# Altium schematic sheet Power Distribution.SchDoc
size A; Organization: Underwater Robotics; Address1: c/o Student Involvement; Address2: Campus Box 7306; Address3: 2016 Cates Ave. Raleigh, NC 27695; Revision: A1; SheetNumber: 2C; SheetTotal: 2C
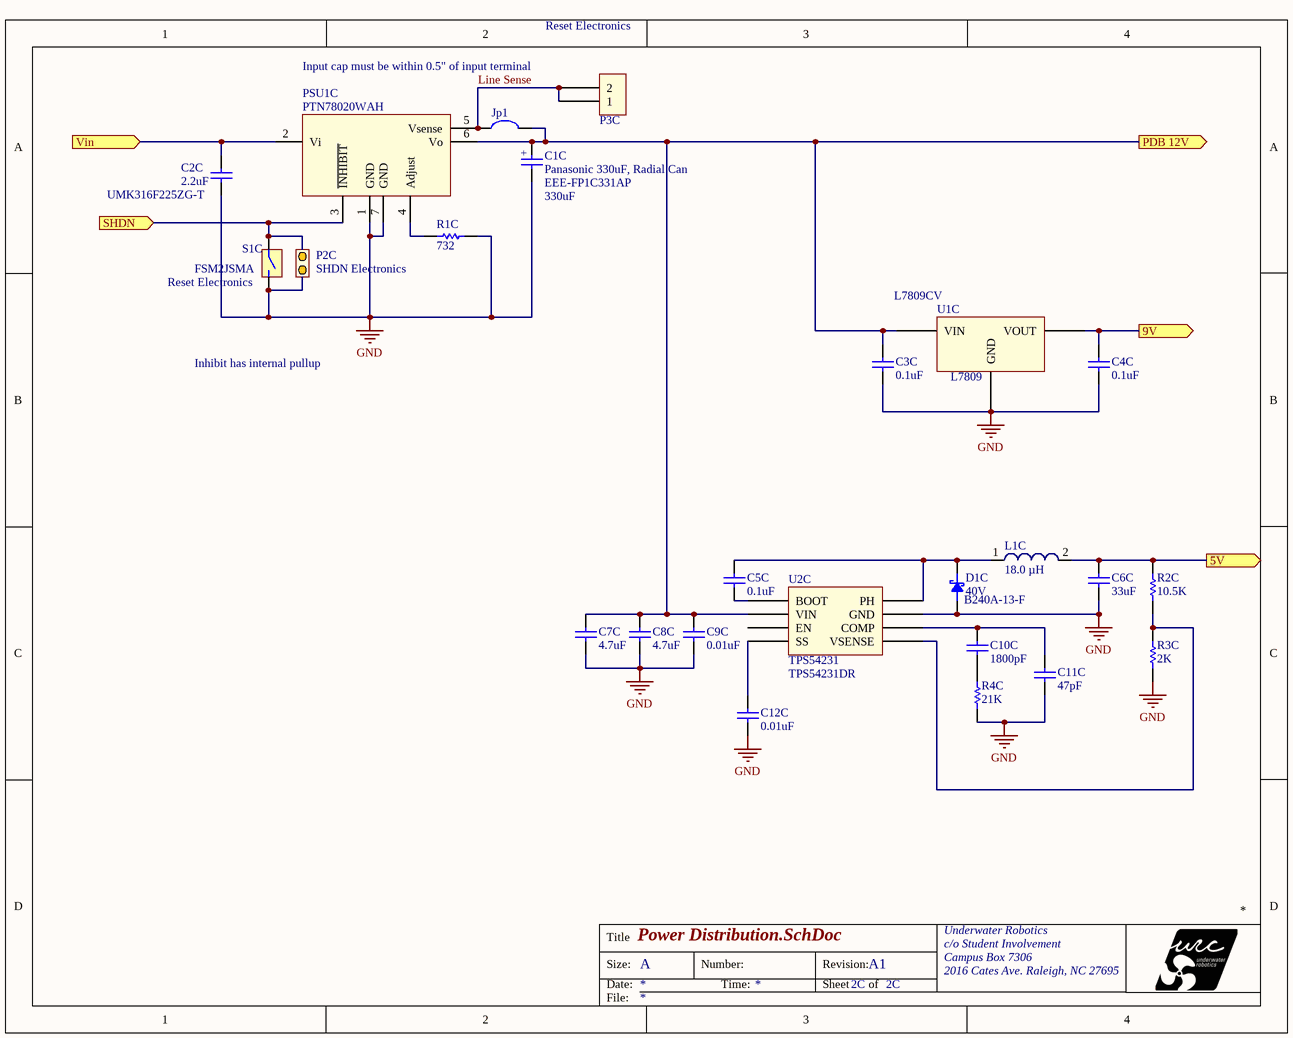
[diagram p0: Power Distribution.SchDoc]

## Parts
C1C  Panasonic 330uF, Radial Can  value 330uF  [EEE-FP1C331AP]
C2C  value 2.2uF  Manufacturer Part Number: UMK316F225ZG-T  [C1206]  (hidden comment: 2.2uF, C1206 TY , Ceramic MLCC)
C3C  value 0.1uF  [C0603]  (hidden comment: 0.1uF, C0603, MultiComp)
C4C  value 0.1uF  [C0603]  (hidden comment: 0.1uF, C0603, MultiComp)
C5C  value 0.1uF  [C0603]  (hidden comment: 0.1uF, C0603, MultiComp)
C6C  value 33uF  [C1210]  (hidden comment: 33uF, 6.3V, C1210, TDK)
C7C  value 4.7uF  [C0805]  (hidden comment: 4.7uF, C0805, Multicomp)
C8C  value 4.7uF  [C0805]  (hidden comment: 4.7uF, C0805, Multicomp)
C9C  value 0.01uF  [C0603]  (hidden comment: 0.01uF, C0603, AVX)
C10C  value 1800pF  [C0603]  (hidden comment: 1800pF, 50V, C0603, Multicomp)
C11C  value 47pF  [C0402]  (hidden comment: 47pF, 50V, C0402, Yageo)
C12C  value 0.01uF  [C0603]  (hidden comment: 0.01uF, C0603, AVX)
D1C  value 40V  Manufacturer Part Number: B240A-13-F  [SCHOTTKY-B220/A]  (hidden comment: Shottky)
Jp1  Jumper  [Jumper (optional) SMD]  (value not drawn)
L1C  18.0 µH  [WE-PD 1245]
P2C  Header  [1x2 Header]  (value not drawn)
P3C  Header  [1x2 Header]  (value not drawn)
PSU1C  Manufacturer Part Number: PTN78020WAH  [PTN78020]  (hidden comment: PTN78020W)
R1C  value 732  [R0402]  (hidden comment: Resistor)
R2C  value 10.5K  [R0603]  (hidden comment: Resistor)
R3C  value 2K  [R0603]  (hidden comment: Resistor)
R4C  value 21K  [R0603]  (hidden comment: Resistor)
S1C  FSM2JSMA  [FSM2JSMA]
U1C  L7809  Manufacturer Part Number: L7809CV  [L7809CD2T-D2PAK]
U2C  TPS54231  Manufacturer Part Number: TPS54231DR  [TPS54231-SOIC8]

## Ports
5V (out), 9V (out), PDB 12V (out), SHDN (in), Vin (in)

## Nets
GND: C1C.2 C2C.2 C3C.2 C4C.2 C6C.2 C7C.2 C8C.2 C9C.2 C11C.2 C12C.2 D1C.2 P2C.2 PSU1C.1(GND) PSU1C.7(GND) R1C.2 R3C.1 R4C.1 S1C.3 S1C.4 U1C.GND U2C.GND
5V: C6C.1(+) L1C.2 R2C.2 ; port 5V
9V: C4C.1(+) U1C.OUTPUT(VOUT) ; port 9V
Line Sense: Jp1.1 P3C.1 P3C.2 PSU1C.5(Vsense)
PDB 12V: C1C.1(+) C3C.1(+) C7C.1(+) C8C.1(+) C9C.1(+) Jp1.2 PSU1C.6(Vo) U1C.INPUT(VIN) U2C.VIN ; port PDB 12V
SHDN: P2C.1 PSU1C.3(~{INHIBIT}) S1C.1 S1C.2 ; port SHDN
Vin: C2C.1(+) PSU1C.2(Vi) ; port Vin
NetC5C_1: C5C.1(+) D1C.1 L1C.1 U2C.PH
NetC5C_2: C5C.2 U2C.BOOT
NetC10C_1: C10C.1(+) C11C.1(+) U2C.COMP
NetC10C_2: C10C.2 R4C.2
NetC12C_1: C12C.1(+) U2C.SS
NetPSU1C_4: PSU1C.4(Adjust) R1C.1
NetR2C_1: R2C.1 R3C.2 U2C.VSENSE

Not connected (* = marked no-connect by the designer): U2C EN

## Notes on the sheet
- Reset Electronics
- (near P3C) Input cap must be within 0.5" of input terminal
- (near S1C) Reset Electronics
- (near P2C) SHDN Electronics
- Inhibit has internal pullup
- Title
- Size:
- Date:
- A
- Number:
- Time:
- Revision:
- Sheet
- of
- File:

## Library data of the parts
C1C = Panasonic 330uF, Radial Can: Aluminum Radial Can, Panasonic, 330uF, 16V, SMD; Manufacturer 1: PANASONIC ELECTRONIC COMPONENTS; Description 1: PANASONIC ELECTRONIC COMPONENTS - EEE-FP1C331AP - ALUMINUM ELECTROLYTIC CAPACITOR, 330UF, 16V, 20%, SMD; Product Range: AEC-Q200 FP Series; Voltage Rating: 16; AE Capacitor Case: Radial Can - SMD; ESR: 0.08; Ripple Current AC: 850; Supplier 1: Newark; Supplier Part Number 1: 32R8907; RoHS: YES; Stock 1: 718; Pricing 1: 1=0.223, 50=0.223, 100=0.223, 250=0.223 (USD); Capacitance: 330 uF; Diameter: 8; Height: 10.2; ComponentLink1URL: http://www.farnell.com/datasheets/370232.pdf; ComponentLink1Description: http://www.farnell.com/datasheets/370232.pdf; ComponentLink2URL: http://www.farnell.com/cad/1703920.zip; ComponentLink2Description: http://www.farnell.com/cad/1703920.zip; Manufacturer Part Number: EEE-FP1C331AP
C2C = 2.2uF, C1206 TY , Ceramic MLCC: Ceramic MLCC, Taiyo Yuden, X7R Dielectric; Description 1: TAIYO YUDEN - UMK316F225ZG-T - CERAMIC CAPACITOR, 2.2UF, 50V, Y5V, +80,-20%, 1206; Supplier 1: Newark; Supplier Part Number 1: 08P5201; Manufacturer 1: TAIYO YUDEN; RoHS: YES; Stock 1: 1843; Pricing 1: 1=0.055, 10=0.055, 50=0.055, 100=0.055, 500=0.055, 1000=0.05 (USD); ComponentLink1URL: http://www.yuden.co.jp/productdata/catalog/en/mlcc_pack_e.pdf; ComponentLink1Description: http://www.yuden.co.jp/productdata/catalog/en/mlcc_pack_e.pdf; ComponentLink2URL: http://www.farnell.com/datasheets/1481447.pdf; ComponentLink2Description: http://www.farnell.com/datasheets/1481447.pdf
C3C C4C C5C = 0.1uF, C0603, MultiComp: Ceramic MLCC, Multicompo, X7R Dielectric; Manufacturer Part Number: MC0603B104K500CT; Description 1: MULTICOMP - MC0603B104K500CT - CERAMIC CAPACITOR, 0.1UF, 50V, X7R, 10%, 0603; Product Range: MC Series; Capacitance: 0.1 F; Capacitance Tolerance: 10%; Dielectric Characteristic: X7; Voltage Rating: 50; Ceramic Capacitor Case: 0603 [1608 Metric]; Supplier 1: Newark; Supplier Part Number 1: 06R4927; Manufacturer 1: MULTICOMP; RoHS: YES; Stock 1: 166516; Pricing 1: 1=0.075, 10=0.048, 50=0.027, 100=0.021, 250=0.017, 500=0.015, 1000=0.012 (USD); Packaging: Cut Tape; ComponentLink1URL: http://www.farnell.com/datasheets/1522998.pdf; ComponentLink1Description: http://www.farnell.com/datasheets/1522998.pdf; ComponentLink2URL: /pdfs/datasheets/spc/Ta-1098.pdf; ComponentLink2Description: /pdfs/datasheets/spc/Ta-1098.pdf
C6C = 33uF, 6.3V, C1210, TDK: Ceramic MLCC, TDK, X5R Dielectric; Manufacturer Part Number: C3225X5R0J336M250AA; Description 1: TDK - C3225X5R0J336M250AA - CERAMIC CAPACITOR, 33UF, 6.3V, X5R, 20%, 1210; Supplier 1: Newark; Supplier Part Number 1: 91R0108; Manufacturer 1: TDK; RoHS: YES; Stock 1: 980; Pricing 1: 1=0.72, 10=0.675, 50=0.54, 100=0.513, 500=0.414 (USD); ComponentLink1URL: http://www.farnell.com/datasheets/1571323.pdf; ComponentLink1Description: http://www.farnell.com/datasheets/1571323.pdf
C7C C8C = 4.7uF, C0805, Multicomp: Ceramic MLCC, Multicomp, X5R Dielectric; Manufacturer Part Number: MC0805X475M100CT; Description 1: MULTICOMP - MC0805X475M100CT - CERAMIC CAPACITOR, 4.7UF, 10V, X5R, 20%, 0805; Supplier 1: Newark; Supplier Part Number 1: 06R4184; Manufacturer 1: MULTICOMP; RoHS: YES; Stock 1: 9541; Pricing 1: 1=0.019, 10=0.019, 50=0.019, 100=0.019, 250=0.019, 500=0.019, 1000=0.019 (USD); ComponentLink1URL: http://www.newark.com/pdfs/datasheets/spc/Ta-1105.pdf; ComponentLink1Description: http://www.newark.com/pdfs/datasheets/spc/Ta-1105.pdf; ComponentLink2URL: /pdfs/datasheets/spc/Ta-1105.pdf; ComponentLink2Description: /pdfs/datasheets/spc/Ta-1105.pdf
C9C C12C = 0.01uF, C0603, AVX: Ceramic MLCC, AVX, X7R Dielectric; Manufacturer Part Number: 06035C103KAT2A; Description 1: AVX - 06035C103KAT2A - CERAMIC CAPACITOR 0.01UF, 50V, X7R, 10%, 0603; Supplier 1: Newark; Supplier Part Number 1: 36K3729; Manufacturer 1: AVX; RoHS: YES; Stock 1: 141733; Pricing 1: 1=0.003, 10=0.003, 100=0.003, 250=0.003, 500=0.003, 1000=0.003 (USD); ComponentLink1URL: http://www.farnell.com/cad/1614338.zip; ComponentLink1Description: http://www.farnell.com/cad/1614338.zip; ComponentLink2URL: http://www.farnell.com/datasheets/1818074.pdf; ComponentLink2Description: http://www.farnell.com/datasheets/1818074.pdf
C10C = 1800pF, 50V, C0603, Multicomp: Ceramic MLCC, Multicomp, X7R Dielectric; Manufacturer Part Number: MC0603B182K500CT; Description 1: MULTICOMP - MC0603B182K500CT - CERAMIC CAPACITOR 1800PF, 50V, X7R, 10%, 0603; Supplier 1: Newark; Supplier Part Number 1: 06R4952; Manufacturer 1: MULTICOMP; RoHS: YES; Stock 1: 13906; Pricing 1: 1=0.001, 10=0.001, 50=0.001, 100=0.001, 250=0.001, 500=0.001, 1000=0.001 (USD); ComponentLink1URL: http://www.farnell.com/datasheets/1522998.pdf; ComponentLink1Description: http://www.farnell.com/datasheets/1522998.pdf; ComponentLink2URL: /pdfs/datasheets/spc/Ta-1098.pdf; ComponentLink2Description: /pdfs/datasheets/spc/Ta-1098.pdf
C11C = 47pF, 50V, C0402, Yageo: Ceramic MLCC, Yageo, C0G/NP0 Dielectric; Manufacturer Part Number: CC0402JRNPO9BN470; Description 1: YAGEO - CC0402JRNPO9BN470 - CERAMIC CAPACITOR 47PF 50V, C0G, 5%, 0402; Supplier 1: Newark; Supplier Part Number 1: 68R4613; Manufacturer 1: YAGEO; RoHS: YES; Stock 1: 18071; Pricing 1: 1=0.1, 10=0.013, 25=0.009, 100=0.006, 250=0.005, 500=0.005, 1000=0.004 (USD); ComponentLink1URL: http://www.farnell.com/datasheets/1443161.pdf; ComponentLink1Description: http://www.farnell.com/datasheets/1443161.pdf; ComponentLink2URL: http://www.yageo.com/pdf/yageo/NP0_16V-to-100V_6.pdf; ComponentLink2Description: http://www.yageo.com/pdf/yageo/NP0_16V-to-100V_6.pdf
D1C = Schottky: Manufacturer: MULTICOMP; Diode Configuration: Single; Repetitive Reverse Voltage Vrrm Max: 40; Forward Current If(AV): 2; Diode Case Style: DO-214; Forward Voltage VF Max: 500; Supplier 1: Newark; Supplier Part Number 1: 65W8554; RoHS: YES; Stock 1: 482; Pricing 1: 1=0.048, 10=0.048, 100=0.048, 1000=0.048 (USD); No. of Pins: 2; Packaging: Cut Tape; ComponentLink1URL: http://www.farnell.com/datasheets/1693630.pdf; ComponentLink1Description: http://www.farnell.com/datasheets/1693630.pdf
Jp1 = Jump Optional: Resistor; Value: xxmil
L1C = WE-PD 1245, LS, 7447715180: SMD-Shielded Power Inductor WE-PD, L=18.0 µH; Manufacturer 1: WURTH ELEKTRONIK; Description 1: WURTH ELEKTRONIK - 7447715180 - INDUCTOR, SHIELDED, 18UH, 3.2A, SMD; Value: 18uH; Inductance: 18.0 µH; Supplier 1: Newark; Supplier Part Number 1: 88T7120; Manufacturer Part Number: 7447715180; RoHS: YES; Stock 1: 3; Pricing 1: 1=2.88, 10=2.69, 25=2.46, 50=2.23, 100=2.02, 200=1.87, 500=1.73 (USD); ComponentLink1URL: http://www.farnell.com/cad/1670107.zip; ComponentLink1Description: http://www.farnell.com/cad/1670107.zip; ComponentLink2URL: http://www.farnell.com/datasheets/1919796.pdf; ComponentLink2Description: http://www.farnell.com/datasheets/1919796.pdf
P2C P3C = 1x2 Header
PSU1C = PTN78020W: Adjustable, non-isolating DC-DC converter; Manufacturer: TEXAS INSTRUMENTS; DC / DC Converter Type: DIP; Output Power Max: 90; Output Voltage Min: 2.5; Output Voltage Max: 12.6; Output Current Max: 6; Input Voltage DC Min: 7; Input Voltage DC Max: 36; Supplier 1: Newark; Supplier Part Number 1: 73J8281; RoHS: YES; Stock 1: 315; Pricing 1: 1=30.26, 10=28.02, 25=25.78, 50=25.14, 100=23.86, 250=21.93, 500=20.97, 1000=20.01 (USD); Height: 9; ComponentLink1URL: http://www.farnell.com/datasheets/1874637.pdf; ComponentLink1Description: http://www.farnell.com/datasheets/1874637.pdf
R1C = 732, 1%, 100mW, Panasonic, R0402: Manufacturer 1: PANASONIC ELECTRONIC COMPONENTS; Manufacturer Part Number: ERJ-2RKF7320X; Tolerance: 1%; Description 1: PANASONIC ELECTRONIC COMPONENTS - ERJ-2RKF7320X - RES, THICK FILM, 732R, 1%, 0.1W, 0402; Supplier 1: Newark; Supplier Part Number 1: 53W4460; RoHS: YES; Stock 1: 34626; Pricing 1: 1=0.002, 50=0.002, 100=0.002, 250=0.002, 500=0.002, 1000=0.002, 5000=0.002 (USD); ComponentLink1URL: http://www.farnell.com/cad/1697903.zip; ComponentLink1Description: http://www.farnell.com/cad/1697903.zip; ComponentLink2URL: http://www.farnell.com/datasheets/1836131.pdf; ComponentLink2Description: http://www.farnell.com/datasheets/1836131.pdf
R2C = 10.5K, 1%, 63mW, Multicomp, R0603: Manufacturer Part Number: MC0063W0603110K5; Tolerance: 1%; Description 1: MULTICOMP - MC0063W0603110K5 - RES, THICK FILM, 10K5, 1%, 0.063W, 0603; Supplier 1: Newark; Supplier Part Number 1: 94W5653; Manufacturer 1: MULTICOMP; RoHS: YES; Stock 1: 49133; Pricing 1: 1=0.001, 10=0.001, 100=0.001, 1000=0.001 (USD); ComponentLink1URL: http://www.farnell.com/datasheets/1788326.pdf; ComponentLink1Description: http://www.farnell.com/datasheets/1788326.pdf
R3C = 2k, 1%, 100mW, Yageo, R0603: Manufacturer 1: YAGEO; Manufacturer Part Number: RC0603FR-072KL; Tolerance: 1%; Description 1: YAGEO - RC0603FR-072KL - RES, THICK FILM, 2K, 1%, 0.1W, 0603; Supplier 1: Newark; Supplier Part Number 1: 68R0063; RoHS: YESX; Stock 1: 2730; Pricing 1: 1=0.09, 10=0.015, 25=0.011, 100=0.006, 250=0.004, 1000=0.003 (USD); ComponentLink1URL: http://www.farnell.com/datasheets/1868787.pdf; ComponentLink1Description: http://www.farnell.com/datasheets/1868787.pdf; ComponentLink2URL: http://www.yageo.com/pdf/PYu-RC0603_51_RoHS_L_4.pdf; ComponentLink2Description: http://www.yageo.com/pdf/PYu-RC0603_51_RoHS_L_4.pdf
R4C = 21K, 1%, 100mW, Vishay, R0603: Manufacturer 1: VISHAY DALE; Manufacturer Part Number: CRCW060321K0FKEA; Tolerance: 1%; Description 1: VISHAY DALE - CRCW060321K0FKEA - RES, THICK FILM, 21K, 1%, 0.1W, 0603; Supplier 1: Newark; Supplier Part Number 1: 52K8277; RoHS: YESX; Stock 1: 6009; Pricing 1: 1=0.004, 10=0.004, 100=0.004, 500=0.004, 1000=0.004 (USD); ComponentLink1URL: http://www.vishay.com/docs/31543/packsmre.pdf; ComponentLink1Description: http://www.vishay.com/docs/31543/packsmre.pdf; ComponentLink2URL: http://www.farnell.com/cad/1552069.zip; ComponentLink2Description: http://www.farnell.com/cad/1552069.zip; ComponentLink3URL: http://www.farnell.com/datasheets/1824995.pdf; ComponentLink3Description: http://www.farnell.com/datasheets/1824995.pdf
S1C = FSM2JSMA: Tactile Switch (OFF-MOM); Manufacturer 1: TE CONNECTIVITY / ALCOSWITCH; Description 1: TE CONNECTIVITY / ALCOSWITCH - FSM2JSMA - SWITCH, TACTILE, SPST-NO, 50mA, SMD; URL: http://search.digikey.com/us/en/products/FSM2JSMA/450-1130-ND/525819; Supplier 1: Newark; Supplier Part Number 1: 92F2864; RoHS: YES; Stock 1: 73; Pricing 1: 1=0.28, 10=0.262, 25=0.253, 50=0.244, 100=0.23, 250=0.217, 500=0.208, 1000=0.158 (USD); ComponentLink1URL: http://www.tycoelectronics.com/commerce/DocumentDelivery/DDEController?Action=showdoc&DocId=Catalog+Section%7F1308111-1_SWITCHES_CORE_PROGRAM_CATALOG%7F0308%7Fpdf%7FEnglish%7FENG_CS_1308111-1_SWITCHES_CORE_PROGRAM_CATALOG_0308.pdf%7F1825041-1; ComponentLink1Description: http://www.tycoelectronics.com/commerce/DocumentDelivery/DDEController?Action=showdoc&DocId=Catalog+Section%7F1308111-1_SWITCHES_CORE_PROGRAM_CATALOG%7F0308%7Fpdf%7FEnglish%7FENG_CS_1308111-1_SWITCHES_CORE_PROGRAM_CATALOG_0308.pdf%7F1825041-1; ComponentLink2URL: http://www.farnell.com/cad/1650702.pdf; ComponentLink2Description: http://www.farnell.com/cad/1650702.pdf; ComponentLink3URL: http://www.farnell.com/datasheets/1668117.pdf; ComponentLink3Description: http://www.farnell.com/datasheets/1668117.pdf; ComponentLink4URL: http://www.farnell.com/datasheets/921681.pdf; ComponentLink4Description: http://www.farnell.com/datasheets/921681.pdf; ComponentLink5URL: http://ecommas.tycoelectronics.com/commerce/DocumentDelivery/DDEController?Action=showdoc&DocId=Catalog+Page%7F1308390_0904_E3_E10%7Fn%2Fa%7Fpdf%7FEnglish%7FENG_CAT_1308390_0904_E3_E10_.pdf; ComponentLink5Description: http://ecommas.tycoelectronics.com/commerce/DocumentDelivery/DDEController?Action=showdoc&DocId=Catalog+Page%7F1308390_0904_E3_E10%7Fn%2Fa%7Fpdf%7FEnglish%7FENG_CAT_1308390_0904_E3_E10_.pdf; Manufacturer Part Number: FSM2JSMA
U1C = L7809: Manufacturer: STMICROELECTRONICS; Input Voltage Min: 15; Input Voltage Max: 35; Output Current: 1.5; Linear Regulator Case Style: TO-220; No. of Pins: 3; Supplier 1: Newark; Supplier Part Number 1: 89K1390; RoHS: YES; Stock 1: 16675; Pricing 1: 1=0.253, 10=0.253, 25=0.253, 100=0.253, 250=0.232, 500=0.232, 1000=0.214, 2500=0.214 (USD); Operating Temperature Min: 0 C; Operating Temperature Max: 125 C; MSL: -; ComponentLink1URL: http://www.farnell.com/datasheets/1805459.pdf; ComponentLink1Description: http://www.farnell.com/datasheets/1805459.pdf; ComponentLink2URL: http://www.st.com/stonline/products/literature/ds/2143/l7809c.pdf; ComponentLink2Description: http://www.st.com/stonline/products/literature/ds/2143/l7809c.pdf
U2C = TPS54231: 2A Switching Regulator; Manufacturer: TEXAS INSTRUMENTS; Supplier 1: Newark; Supplier Part Number 1: 94T5096; RoHS: YES; Stock 1: 1113; Pricing 1: 1=0.649 (USD); ComponentLink1URL: http://www.farnell.com/simulation/1746257.zip; ComponentLink1Description: http://www.farnell.com/simulation/1746257.zip; ComponentLink2URL: http://www.farnell.com/cad/1757598.zip; ComponentLink2Description: http://www.farnell.com/cad/1757598.zip; ComponentLink3URL: http://www.farnell.com/datasheets/1857742.pdf; ComponentLink3Description: http://www.farnell.com/datasheets/1857742.pdf